# Altium schematic sheet 12-JKFlipFlop.SchDoc
size A4
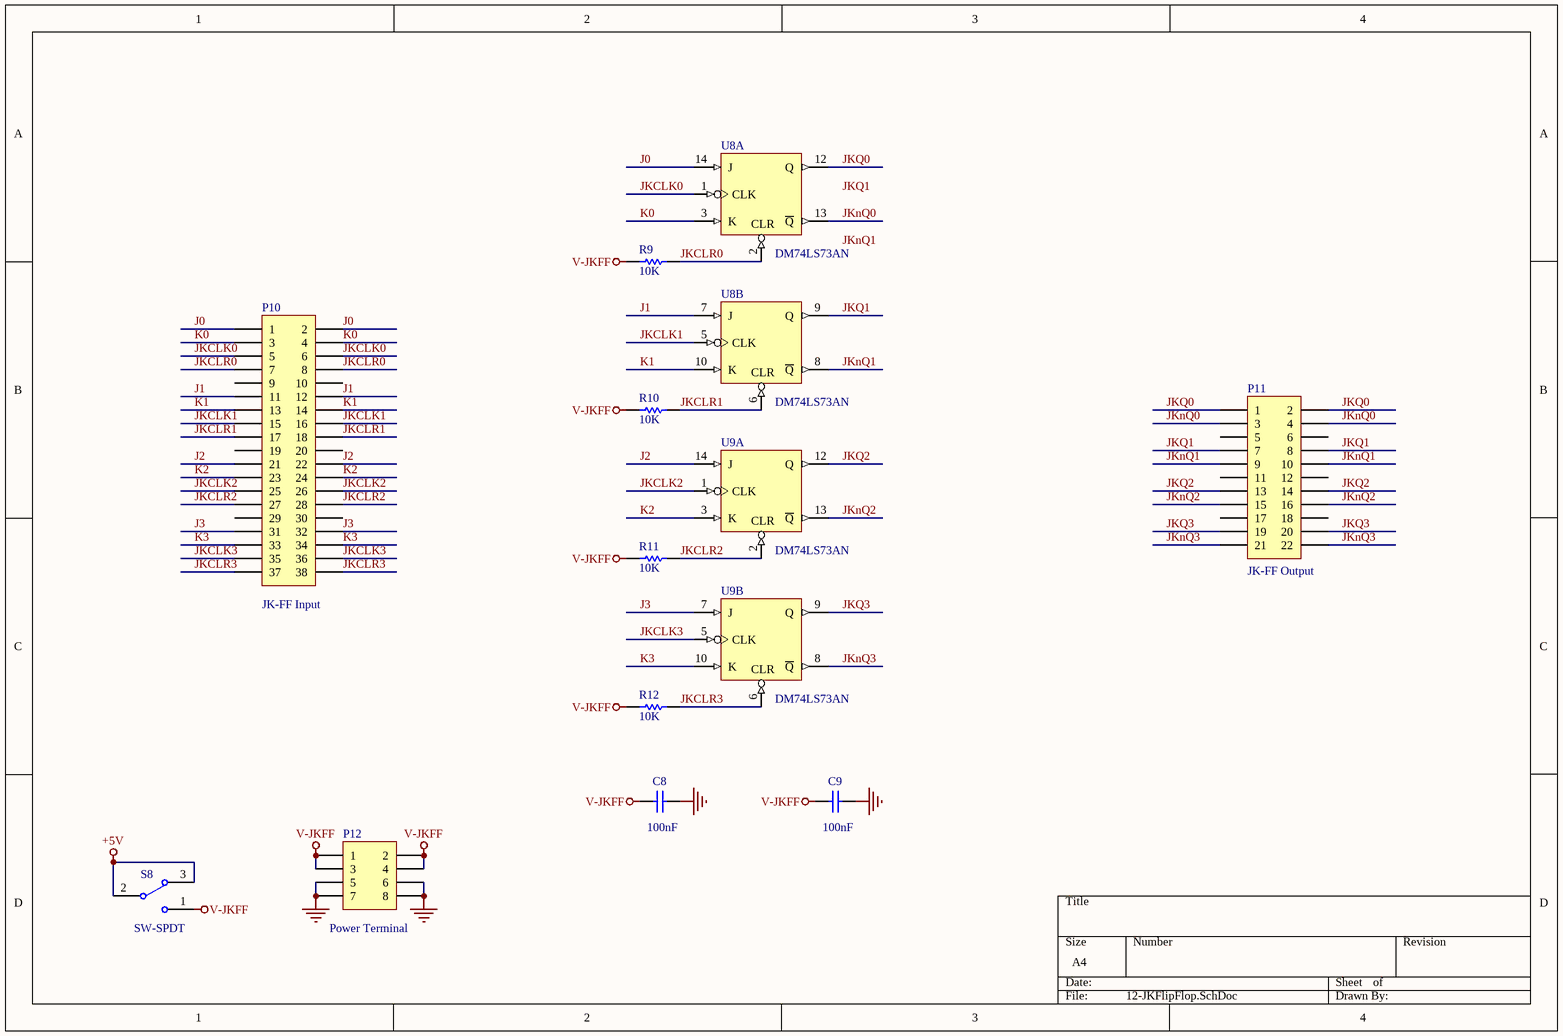
[diagram p0: 12-JKFlipFlop.SchDoc]

## Parts
C8  value 100nF  [c-0805]  (hidden comment: 104)
C9  value 100nF  [c-0805]  (hidden comment: 104)
P10  value JK-FF Input  [HDR2X19]  (hidden comment: Header 19X2)
P11  value JK-FF Output  [HDR2X11]  (hidden comment: Header 11X2)
P12  Publisher: Power Terminal  [HDR2X4]  (hidden comment: Header 4X2)
R9  10K  [r-0805]
R10  10K  [r-0805]
R11  10K  [r-0805]
R12  10K  [r-0805]
S8  SW-SPDT  [SW-DIP1SMD]
U8  DM74LS73AN  [SK-DIP14-300]  (parts A,B of 2)
U9  DM74LS73AN  [SK-DIP14-300]  (parts A,B of 2)

## Nets
+5V: S8.2 S8.3
GND: C8.2 C9.2 P12.5 P12.6 P12.7 P12.8 U8.11(GND) U9.11(GND)
V-JKFF: C8.1 C9.1 P12.1 P12.2 P12.3 P12.4 R9.2 R10.2 R11.2 R12.2 S8.1
VCC: U8.4(V-JKFF) U9.4(V-JKFF)
J0: P10.1 P10.2 U8.14(J)
J1: P10.11 P10.12 U8.7(J)
J2: P10.21 P10.22 U9.14(J)
J3: P10.31 P10.32 U9.7(J)
JKCLK0: P10.5 P10.6 U8.1(CLK)
JKCLK1: P10.15 P10.16 U8.5(CLK)
JKCLK2: P10.25 P10.26 U9.1(CLK)
JKCLK3: P10.35 P10.36 U9.5(CLK)
JKCLR0: P10.7 P10.8 R9.1 U8.2(CLR)
JKCLR1: P10.17 P10.18 R10.1 U8.6(CLR)
JKCLR2: P10.27 P10.28 R11.1 U9.2(CLR)
JKCLR3: P10.37 P10.38 R12.1 U9.6(CLR)
JKnQ0: P11.3 P11.4 U8.13(~{Q})
JKnQ1: P11.9 P11.10 U8.8(~{Q})
JKnQ2: P11.15 P11.16 U9.13(~{Q})
JKnQ3: P11.21 P11.22 U9.8(~{Q})
JKQ0: P11.1 P11.2 U8.12(Q)
JKQ1: P11.7 P11.8 U8.9(Q)
JKQ2: P11.13 P11.14 U9.12(Q)
JKQ3: P11.19 P11.20 U9.9(Q)
K0: P10.3 P10.4 U8.3(K)
K1: P10.13 P10.14 U8.10(K)
K2: P10.23 P10.24 U9.3(K)
K3: P10.33 P10.34 U9.10(K)

Not connected (* = marked no-connect by the designer): P10 9 10 19 20 29 30; P11 5 6 11 12 17 18

## Notes on the sheet
- Labels drawn without touching a wire or pin: JKnQ1, JKQ1

## Library data of the parts
C8 C9 = Cap: Capacitor; Published: 8-Jun-2000; LatestRevisionDate: 17-Jul-2002; LatestRevisionNote: Re-released for DXP Platform.; PackageReference: RAD-0.3; Publisher: Altium Limited; PackageDescription: Radial Cap, Thru-Hole; 2 Leads; 0.3 in Pin Spacing
P10 = Header 19X2: Header, 19-Pin, Dual row; LatestRevisionDate: 17-Jul-2002; LatestRevisionNote: Re-released for DXP Platform.
P11 = Header 11X2: Header, 11-Pin, Dual row; LatestRevisionDate: 17-Jul-2002; LatestRevisionNote: Re-released for DXP Platform.
P12 = Header 4X2: Header, 4-Pin, Dual row; LatestRevisionDate: 17-Jul-2002; LatestRevisionNote: Re-released for DXP Platform.
R9-R12 = Res1: Resistor; Published: 8-Jun-2000; LatestRevisionDate: 17-Jul-2002; LatestRevisionNote: Re-released for DXP Platform.; PackageReference: AXIAL-0.3; Publisher: Altium Limited; PackageDescription: Axial Device, Thru-Hole; 2 Leads; 0.3 in Pin Spacing; Value: 10K
S8 = SW-SPDT: SPDT Subminiature Toggle Switch, Right Angle Mounting, Vertical Actuation; Published: 24-Mar-1999; LatestRevisionDate: 17-Dec-2003; LatestRevisionNote: Schematic revised, PCB Footprint replaced.; DatasheetVersion: 05-Dec-2000; PackageReference: TL36WW15050; Publisher: Altium Limited; PackageDescription: Switch; 4 Leads; ComponentLink1Description: Manufacturer Link; ComponentLink1URL: http://www.apem.com
U8 U9 = DM74LS73AN: Dual Negative-Edge-Triggered Master-Slave J-K Flip-Flop with Clear and Complementary Output; Published: 17-Jul-2002; LatestRevisionDate: 29-May-2009; LatestRevisionNote: Component Body Added.; DatasheetVersion: Mar-1998; PackageVersion: 2000; PackageReference: N14A; Publisher: Altium Limited; PackageDescription: DIP, 14-Pin, Row Spacing 7.62 mm, Pitch 2.54 mm; ComponentLink1Description: Manufacturer Link; ComponentLink1URL: http://www.fairchildsemi.com/